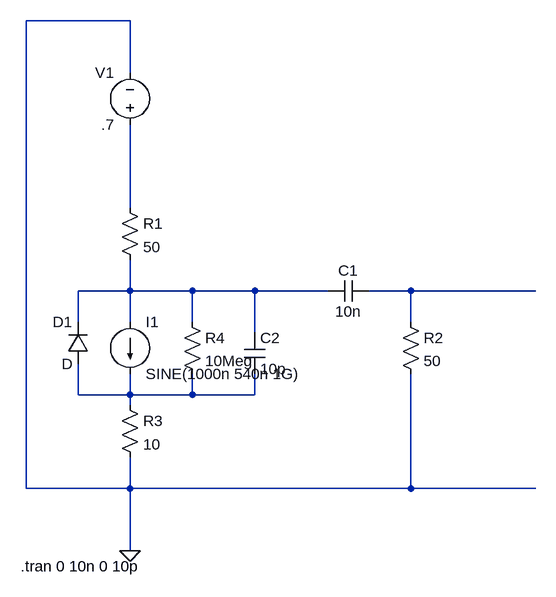
[diagram p0: schematic Draft1.asc]
Draft1.asc, the LTspice schematic file:
Version 4.1
SHEET 1 1012 680
WIRE 384 -176 224 -176
WIRE 384 -96 384 -176
WIRE 384 112 384 -16
WIRE 384 240 384 192
WIRE 384 240 304 240
WIRE 480 240 384 240
WIRE 576 240 480 240
WIRE 688 240 576 240
WIRE 816 240 752 240
WIRE 1008 240 816 240
WIRE 304 288 304 240
WIRE 384 288 384 240
WIRE 480 288 480 240
WIRE 816 288 816 240
WIRE 576 304 576 240
WIRE 304 400 304 352
WIRE 384 400 384 368
WIRE 384 400 304 400
WIRE 480 400 480 368
WIRE 480 400 384 400
WIRE 576 400 576 368
WIRE 576 400 480 400
WIRE 384 416 384 400
WIRE 224 544 224 -176
WIRE 384 544 384 496
WIRE 384 544 224 544
WIRE 816 544 816 368
WIRE 816 544 384 544
WIRE 1008 544 816 544
WIRE 384 640 384 544
FLAG 384 640 0
SYMBOL current 384 288 R0
WINDOW 123 0 0 Left 0
WINDOW 39 0 0 Left 0
SYMATTR InstName I1
SYMATTR Value SINE(1000n 540n 1G)
SYMBOL res 368 96 R0
SYMATTR InstName R1
SYMATTR Value 50
SYMBOL voltage 384 0 R180
WINDOW 0 24 96 Left 2
WINDOW 3 24 16 Left 2
WINDOW 123 0 0 Left 0
WINDOW 39 0 0 Left 0
SYMATTR InstName V1
SYMATTR Value .7
SYMBOL cap 752 224 R90
WINDOW 0 0 32 VBottom 2
WINDOW 3 32 32 VTop 2
SYMATTR InstName C1
SYMATTR Value 10n
SYMBOL res 800 272 R0
SYMATTR InstName R2
SYMATTR Value 50
SYMBOL res 368 400 R0
SYMATTR InstName R3
SYMATTR Value 10
SYMBOL diode 320 352 R180
WINDOW 0 24 64 Left 2
WINDOW 3 24 0 Left 2
SYMATTR InstName D1
SYMBOL res 464 272 R0
SYMATTR InstName R4
SYMATTR Value 10Meg
SYMBOL cap 560 304 R0
SYMATTR InstName C2
SYMATTR Value 10p
TEXT 216 664 Left 2 !.tran 0 10n 0 10p

The netlist it stands for:
* Draft1.asc
I1 N002 N004 SINE(1000n 540n 1G)
R1 N001 N002 50
V1 N001 0 .7
C1 N003 N002 10n
R2 N003 0 50
R3 N004 0 10
D1 N004 N002 D
R4 N002 N004 10Meg
C2 N002 N004 10p
.model D D
.lib standard.dio
.tran 0 10n 0 10p
.backanno
.end